# EAGLE design encoder (EAGLE 9.0.0)
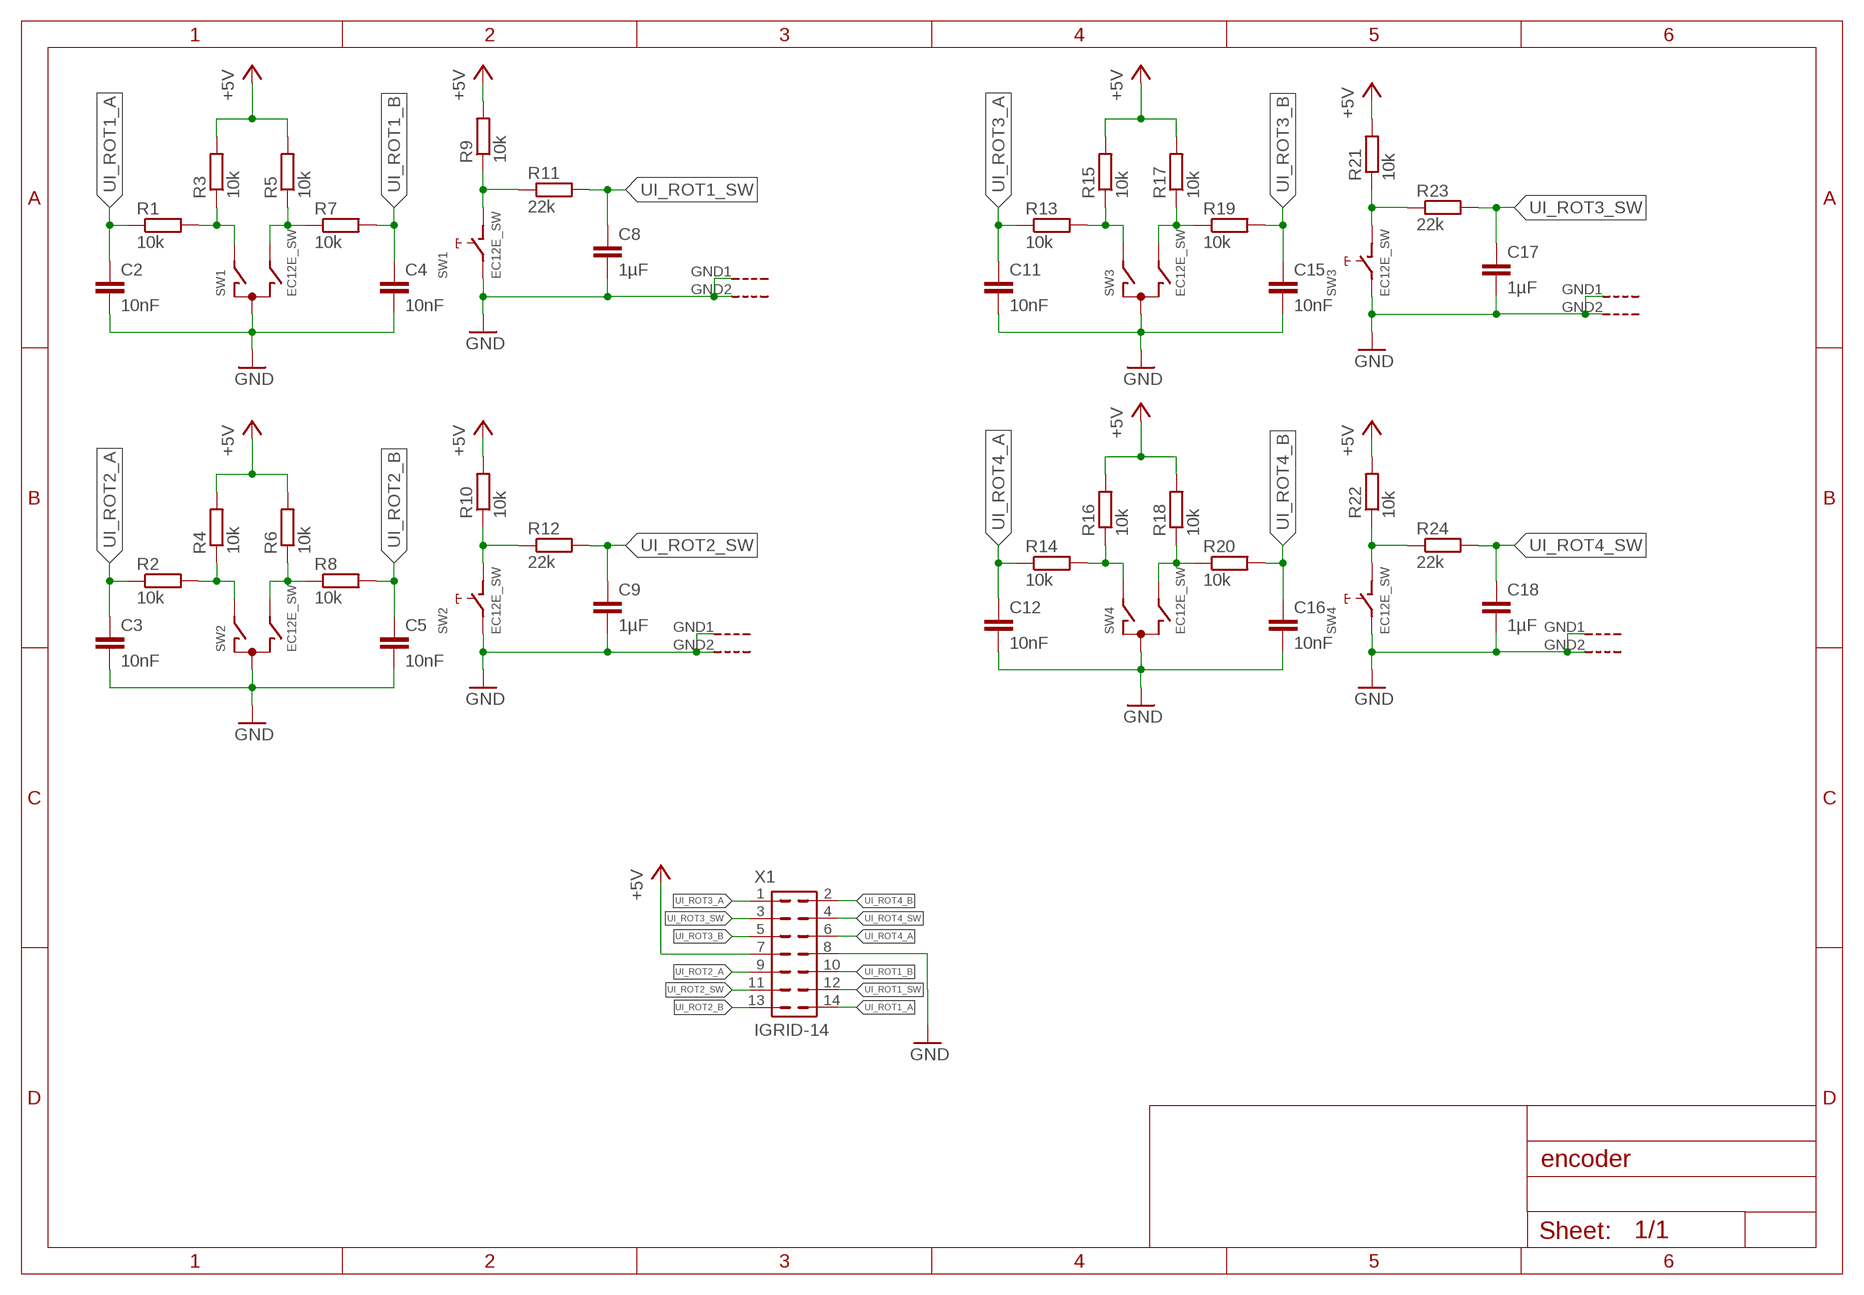
[diagram p0: schematic, sheet 1]

## Parts
C2  10nF  C-EUC0805  [C0805]
C3  10nF  C-EUC0805  [C0805]
C4  10nF  C-EUC0805  [C0805]
C5  10nF  C-EUC0805  [C0805]
C8  1µF  C-EUC0805  [C0805]
C9  1µF  C-EUC0805  [C0805]
C11  10nF  C-EUC0805  [C0805]
C12  10nF  C-EUC0805  [C0805]
C15  10nF  C-EUC0805  [C0805]
C16  10nF  C-EUC0805  [C0805]
C17  1µF  C-EUC0805  [C0805]
C18  1µF  C-EUC0805  [C0805]
R1  10k  R-EU_R0805  [R0805]
R2  10k  R-EU_R0805  [R0805]
R3  10k  R-EU_R0805  [R0805]
R4  10k  R-EU_R0805  [R0805]
R5  10k  R-EU_R0805  [R0805]
R6  10k  R-EU_R0805  [R0805]
R7  10k  R-EU_R0805  [R0805]
R8  10k  R-EU_R0805  [R0805]
R9  10k  R-EU_R0805  [R0805]
R10  10k  R-EU_R0805  [R0805]
R11  22k  R-EU_R0805  [R0805]
R12  22k  R-EU_R0805  [R0805]
R13  10k  R-EU_R0805  [R0805]
R14  10k  R-EU_R0805  [R0805]
R15  10k  R-EU_R0805  [R0805]
R16  10k  R-EU_R0805  [R0805]
R17  10k  R-EU_R0805  [R0805]
R18  10k  R-EU_R0805  [R0805]
R19  10k  R-EU_R0805  [R0805]
R20  10k  R-EU_R0805  [R0805]
R21  10k  R-EU_R0805  [R0805]
R22  10k  R-EU_R0805  [R0805]
R23  22k  R-EU_R0805  [R0805]
R24  22k  R-EU_R0805  [R0805]
SW1  EC12E_SW  [ALPS_EC12E_SW]
SW2  EC12E_SW  [ALPS_EC12E_SW]
SW3  EC12E_SW  [ALPS_EC12E_SW]
SW4  EC12E_SW  [ALPS_EC12E_SW]
X1  IGRID-14  [I-GRID-14]

## Nets
+5V [PWR]: R3.2 R4.2 R5.2 R6.2 R9.2 R10.2 R15.2 R16.2 R17.2 R18.2 R21.2 R22.2 X1.7
GND [PWR]: C2.2 C3.2 C4.2 C5.2 C8.2 C9.2 C11.2 C12.2 C15.2 C16.2 C17.2 C18.2 SW1.C SW1.E SW1.GND1(G) SW1.GND2(G) SW2.C SW2.E SW2.GND1(G) SW2.GND2(G) SW3.C SW3.E SW3.GND1(G) SW3.GND2(G) SW4.C SW4.E SW4.GND1(G) SW4.GND2(G) X1.8
UI_ROT1_A: C2.1 R1.1 X1.14
UI_ROT1_A_UNFIL: R1.2 R3.1 SW1.A
UI_ROT1_B: C4.1 R7.2 X1.10
UI_ROT1_B_UNFIL: R5.1 R7.1 SW1.B
UI_ROT1_SW: C8.1 R11.2 X1.12
UI_ROT1_SW_R: R9.1 R11.1 SW1.D
UI_ROT2_A: C3.1 R2.1 X1.9
UI_ROT2_A_UNFIL: R2.2 R4.1 SW2.A
UI_ROT2_B: C5.1 R8.2 X1.13
UI_ROT2_B_UNFIL: R6.1 R8.1 SW2.B
UI_ROT2_SW: C9.1 R12.2 X1.11
UI_ROT2_SW_R: R10.1 R12.1 SW2.D
UI_ROT3_A: C11.1 R13.1 X1.1
UI_ROT3_A_UNFIL: R13.2 R15.1 SW3.A
UI_ROT3_B: C15.1 R19.2 X1.5
UI_ROT3_B_UNFIL: R17.1 R19.1 SW3.B
UI_ROT3_SW: C17.1 R23.2 X1.3
UI_ROT3_SW_R: R21.1 R23.1 SW3.D
UI_ROT4_A: C12.1 R14.1 X1.6
UI_ROT4_A_UNFIL: R14.2 R16.1 SW4.A
UI_ROT4_B: C16.1 R20.2 X1.2
UI_ROT4_B_UNFIL: R18.1 R20.1 SW4.B
UI_ROT4_SW: C18.1 R24.2 X1.4
UI_ROT4_SW_R: R22.1 R24.1 SW4.D

## Library data of the parts
C2-C5 C11 C12 C15 C16 = rcl:C-EU: CAPACITOR, European symbol; OC_MOUSER: 710-885012207072; SPICEPREFIX: C
C8 C9 C17 C18 = rcl:C-EU: CAPACITOR, European symbol; OC_MOUSER: 80-C0805C105M3R; SPICEPREFIX: C
R1-R10 R13-R22 = rcl:R-EU_: RESISTOR, European symbol; OC_MOUSER: 603-RC0805FR-0710KL; SPICEPREFIX: R
R11 R12 R23 R24 = rcl:R-EU_: RESISTOR, European symbol; OC_MOUSER: 603-RC0805FR-0722KL; SPICEPREFIX: R
SW1-SW4 = switch-alps:EC12E_SW: ALPS rotary Encoder EC12E series with switch; MPN: EC12E2424407; OC_FARNELL: 1520813; OC_NEWARK: 74M1068
X1 = solderpi:IGRID-14

## Net classes
0 default: width 0.2 mm, drill 0.3 mm, clearance 0.3 mm
1 PWR: width 0.3 mm, drill 0.35 mm, clearance 0.3 mm

## Board
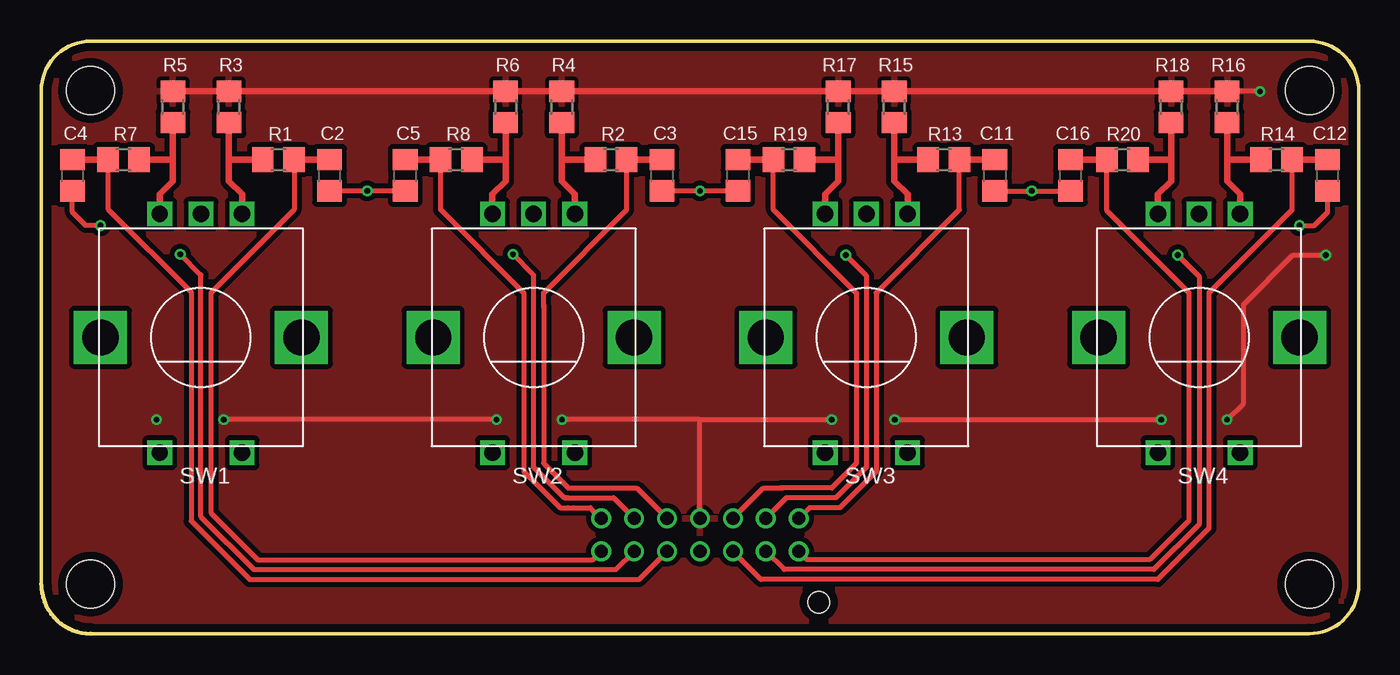
[diagram p1: board, top side]
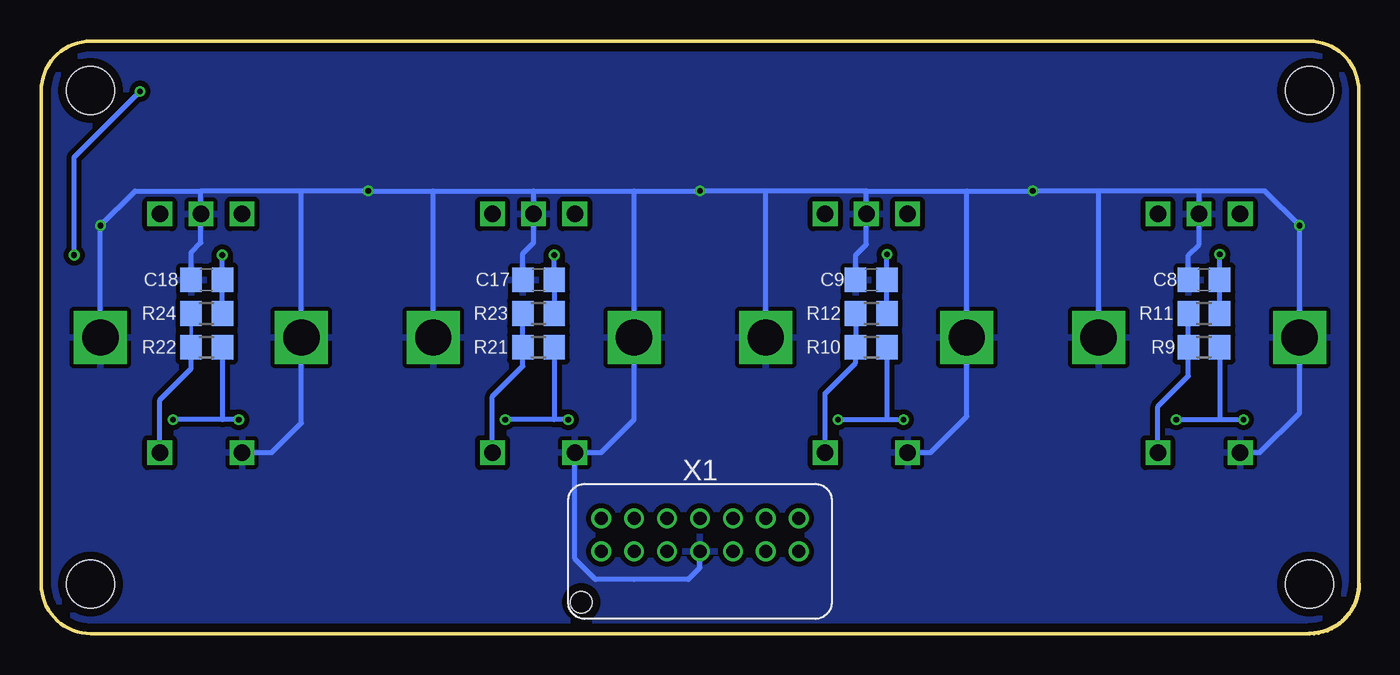
[diagram p2: board, bottom side, seen from below]

Size 80 x 36 mm. Coordinates in mm from the lower left corner, seen from the top.
Outline: 77,36 3,36 arc90 0,33 0,3 arc90 3,0 77,0 arc90 80,3 80,33 arc90 77,36
Copper layers (1*16): Top 0.035mm / dielectric 1.6mm / Bottom 0.035mm
Design rules "Elecrow_2-layer_PCB_eagle_rule *": minimum track width 6mil, minimum drill 12mil, track to track 6mil, track to pad 6mil, pad to pad 6mil, via to via 8mil, smd to smd 0mil, copper to edge 20mil, drill to drill 10mil, minimum pad ring 6mil, minimum via ring 6mil, stop-mask expansion 0mil, vias tented up to drill 100mil, thermal gap 10mil
Holes 2.9 mm at 3,3 77,3 77,33 3,33

### Footprints (pad centres in the part's own frame; a part is rotated, then mirrored left to right if it is on the bottom)
C0805 = smd 1.3 x 1.5: 1 -0.95,0; 2 0.95,0
R0805 = smd 1.3 x 1.5: 1 -0.95,0; 2 0.95,0
ALPS_EC12E_SW = drill 1 square: A -2.5,-7.5; B 2.5,-7.5; C 0,-7.5; D -2.5,7; E 2.5,7 | drill 2.2 square: GND1 -6.1,0; GND2 6.1,0
I-GRID-14 = drill 0.8: 1 -6,2; 2 -6,0; 3 -4,2; 4 -4,0; 5 -2,2; 6 -2,0; 7 0,2; 8 0,0; 9 2,2; 10 2,0; 11 4,2; 12 4,0; 13 6,2; 14 6,0 | hole 1.3: -7.2,-3.1

### Placement (x,y rotation side)
C2  17.5,27.85 270 top
C3  37.7,27.85 270 top
C4  1.9,27.85 270 top
C5  22.1,27.85 270 top
C8  9.4,21.5 180 bottom
C9  29.6,21.5 180 bottom
C11  57.9,27.85 270 top
C12  78.1,27.85 270 top
C15  42.3,27.85 270 top
C16  62.5,27.85 270 top
C17  49.8,21.5 180 bottom
C18  69.95,21.5 180 bottom
R1  14.4,28.8 180 top
R2  34.6,28.8 180 top
R3  11.4,32 90 top
R4  31.6,32 90 top
R5  8,32 90 top
R6  28.2,32 90 top
R7  5,28.8 180 top
R8  25.2,28.8 180 top
R9  9.4,17.4 0 bottom
R10  29.6,17.4 0 bottom
R11  9.4,19.45 0 bottom
R12  29.6,19.45 0 bottom
R13  54.8,28.8 180 top
R14  75,28.8 180 top
R15  51.8,32 90 top
R16  72,32 90 top
R17  48.4,32 90 top
R18  68.6,32 90 top
R19  45.4,28.8 180 top
R20  65.65,28.8 180 top
R21  49.8,17.4 0 bottom
R22  69.95,17.4 0 bottom
R23  49.8,19.45 0 bottom
R24  69.95,19.45 0 bottom
SW1  9.7,18 180 top
SW2  29.9,18 180 top
SW3  50.1,18 180 top
SW4  70.3,18 180 top
X1  40,5 0 bottom

### Tracks (layer width: path | path; a pad name or v marks a point on that pad's centre or on a via)
+5V  (via drill 0.35)
  Top 0.3: 40,13 v48,13 | v51.82,13 v68,13 | 40,13 v31.62,13 | v27.65,13 v11.08,13 | v72,13 73,14 73,20 76,23 v78,23 | v74,32.95 R16.2 | X1.7 40,13
  Top 0.4: R5.2 R3.2 R6.2 R4.2 R17.2 R15.2 R18.2 R16.2
  Bottom 0.3: v48,13 48.85,13 | 48.85,13 v51.82,13 | R21.2 48.85,13 | v31.62,13 28.65,13 | 28.65,13 v27.65,13 | R10.2 28.65,13 | v68,13 69,13 | 69,13 v72,13 | v78,23 78,28.95 v74,32.95 | R22.2 69,13 | v11.08,13 8.45,13 | 8.45,13 v7,13 | R9.2 8.45,13
  pour Top (isolate 0.305): 0,36 80,36 80,0 0,0
GND  (via drill 0.35)
  Top 0.3: C16.2 v60.15,26.9 C11.2 | C15.2 v40,26.9 C3.2 | C5.2 v19.8,26.9 C2.2 | v3.6,24.8 2.7,24.8 1.9,25.6 C4.2 | v76.4,24.8 77.3,24.8 78.1,25.6 C12.2
  Bottom 0.3: C8.2 10.35,23 9.7,23.65 SW1.C 9.7,26.9 | C9.2 30.55,23 29.9,23.65 SW2.C 29.9,26.9 | C17.2 50.75,23.1 50.1,23.75 SW3.C 50.1,26.9 | C18.2 70.9,23.15 70.3,23.75 SW4.C 70.3,26.9 | 9.7,26.9 15.8,26.9 | 15.8,26.9 v19.8,26.9 23.8,26.9 | 29.9,26.9 23.8,26.9 | 29.9,26.9 36,26.9 | 36,26.9 v40,26.9 44,26.9 | 56.2,26.9 v60.15,26.9 64.2,26.9 | 56.2,26.9 50.1,26.9 | 50.1,26.9 44,26.9 | 64.2,26.9 70.3,26.9 | SW1.GND1 15.8,26.9 | 23.8,26.9 SW2.GND2 23.8,13.2 26,11 SW2.E | SW2.GND1 36,26.9 | 44,26.9 SW3.GND2 44,13 46,11 SW3.E 47.6,4.55 46.35,3.3 44,3.3 40.7,3.3 40,4 X1.8 | SW3.GND1 56.2,26.9 | 64.2,26.9 SW4.GND2 64.2,12.8 66,11 SW4.E | 9.7,26.9 5.7,26.9 v3.6,24.8 SW1.GND2 3.6,13.4 6,11 SW1.E | SW4.GND1 v76.4,24.8 74.3,26.9 70.3,26.9
  pour Bottom (isolate 0.305): 0,36 80,36 80,0 0,0
UI_ROT1_A
  Top 0.3: R1.1 15.35,25.75 10.3,20.7 10.3,7.35 13.15,4.5 33.5,4.5 X1.14
  Top 0.4: R1.1 C2.1
UI_ROT1_A_UNFIL
  Top 0.4: SW1.A 12.2,26.7 11.4,27.5 11.4,28.8 | 11.4,28.8 R3.1 | R1.2 11.4,28.8
UI_ROT1_B
  Top 0.3: R7.2 4.05,25.8 9.1,20.75 9.1,6.85 12.65,3.3 36.3,3.3 X1.10
  Top 0.4: R7.2 C4.1
UI_ROT1_B_UNFIL
  Top 0.4: 8,28.8 8,27.5 7.2,26.7 SW1.B | 8,28.8 R5.1 | R7.1 8,28.8
UI_ROT1_SW  (via drill 0.35)
  Top 0.3: v8.45,23.05 9.7,21.8 9.7,7.1 12.9,3.9 34.9,3.9 X1.12
  Bottom 0.3: R11.2 C8.1 v8.45,23.05
UI_ROT1_SW_R
  Bottom 0.3: SW1.D 12.2,13.8 10.35,15.65 R9.1 R11.1
UI_ROT2_A
  Top 0.3: 30.5,19.85 30.5,20 | 30.5,20 30.5,20.7 35.55,25.75 R2.1 | 30.5,20 30.5,10.35 32,8.85 36.15,8.85 X1.9
  Top 0.4: R2.1 C3.1
UI_ROT2_A_UNFIL
  Top 0.4: SW2.A 32.4,26.7 31.6,27.5 31.6,28.8 | R2.2 31.6,28.8 | 31.6,28.8 R4.1
UI_ROT2_B
  Top 0.3: R8.2 24.25,25.75 29.3,20.7 29.3,9.85 31.5,7.65 32,7.65 | 32,7.65 32.35,7.65 | 32,7.65 33.35,7.65 X1.13
  Top 0.4: C5.1 R8.2
UI_ROT2_B_UNFIL
  Top 0.4: SW2.B 27.4,26.7 28.2,27.5 28.2,28.8 | R8.1 28.2,28.8 | 28.2,28.8 R6.1
UI_ROT2_SW  (via drill 0.35)
  Top 0.3: v28.65,23.05 29.9,21.8 29.9,10.1 31.75,8.25 | 31.75,8.25 32,8.25 | 32,8.25 31.75,8.25 | X1.11 34.75,8.25 32,8.25
  Bottom 0.3: R12.2 C9.1 v28.65,23.05
UI_ROT2_SW_R
  Bottom 0.3: SW2.D 32.4,14.6 30.55,16.45 R10.1 R12.1
UI_ROT3_A
  Top 0.3: R13.1 55.75,25.75 50.7,20.7 50.7,9.85 48.5,7.65 46.65,7.65 X1.1
  Top 0.4: R13.1 C11.1
UI_ROT3_A_UNFIL
  Top 0.4: SW3.A 52.6,26.7 51.8,27.5 51.8,28.8 | 51.8,28.8 R15.1 | R13.2 51.8,28.8
UI_ROT3_B
  Top 0.3: R19.2 44.45,25.75 49.5,20.7 49.5,10.35 48,8.85 45,8.85 | 45,8.85 44.85,8.85 | X1.5 43.85,8.85 45,8.85
  Top 0.4: C15.1 R19.2
UI_ROT3_B_UNFIL
  Top 0.4: SW3.B 47.6,26.7 48.4,27.5 48.4,28.8 | 48.4,28.8 R17.1 | R19.1 48.4,28.8
UI_ROT3_SW  (via drill 0.35)
  Top 0.3: v48.85,23 50.1,21.75 50.1,10.1 48.25,8.25 45.25,8.25 X1.3
  Bottom 0.3: R23.2 C17.1 v48.85,23
UI_ROT3_SW_R
  Bottom 0.3: SW3.D 52.6,14.4 50.75,16.25 R21.1 R23.1
UI_ROT4_A
  Top 0.3: R14.1 75.95,25.75 70.9,20.7 70.9,6.4 67.8,3.3 43.7,3.3 X1.6
  Top 0.4: R14.1 C12.1
UI_ROT4_A_UNFIL
  Top 0.4: SW4.A 72.8,26.7 72,27.5 72,28.8 | 72,28.8 R16.1 | R14.2 72,28.8
UI_ROT4_B
  Top 0.3: R20.2 64.7,25.7 69.7,20.7 69.7,6.9 67.3,4.5 46.5,4.5 X1.2
  Top 0.4: C16.1 R20.2
UI_ROT4_B_UNFIL
  Top 0.4: SW4.B 67.8,26.7 68.6,27.5 68.6,28.8 | R20.1 68.6,28.8 | 68.6,28.8 R18.1
UI_ROT4_SW  (via drill 0.35)
  Top 0.3: v69,23 70.3,21.7 70.3,6.65 67.55,3.9 45.1,3.9 X1.4
  Bottom 0.3: v69,23 C18.1 R24.2
UI_ROT4_SW_R
  Bottom 0.2: R22.1 R24.1
  Bottom 0.3: SW4.D 72.8,14.2 70.9,16.1 R22.1